# Altium project PCB_Project.PrjPcb
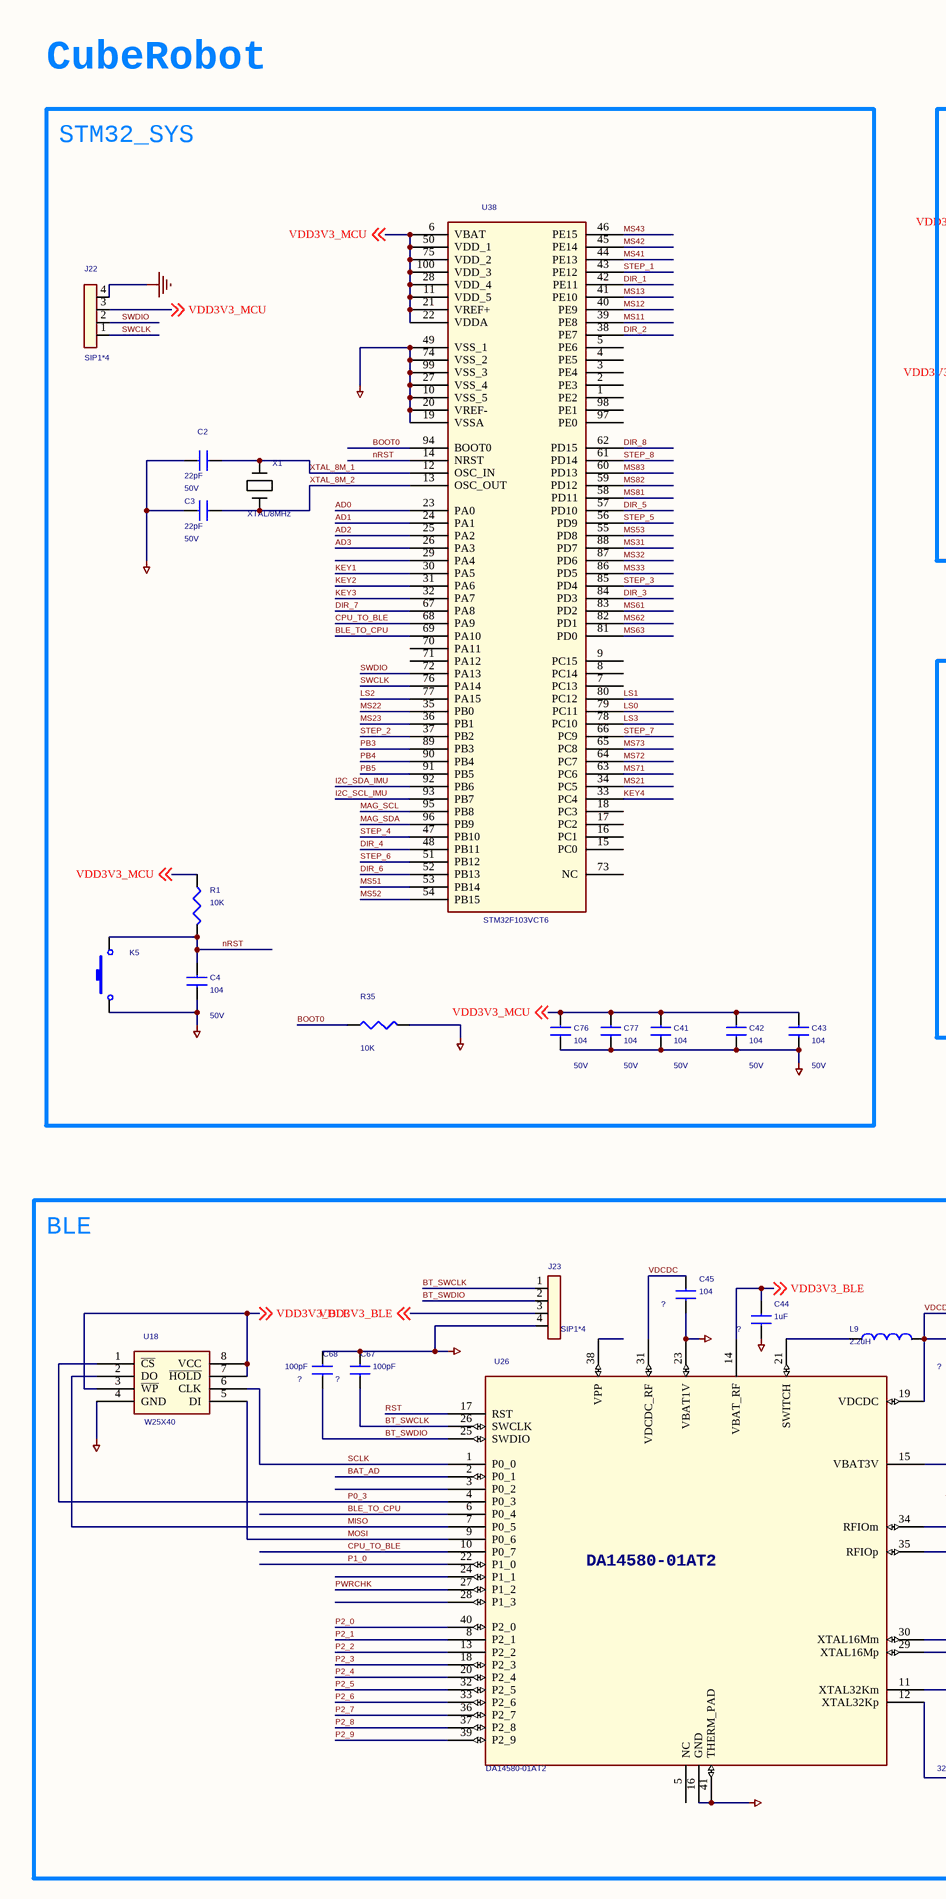
[diagram p0: Cube_Robot.SchDoc, left]
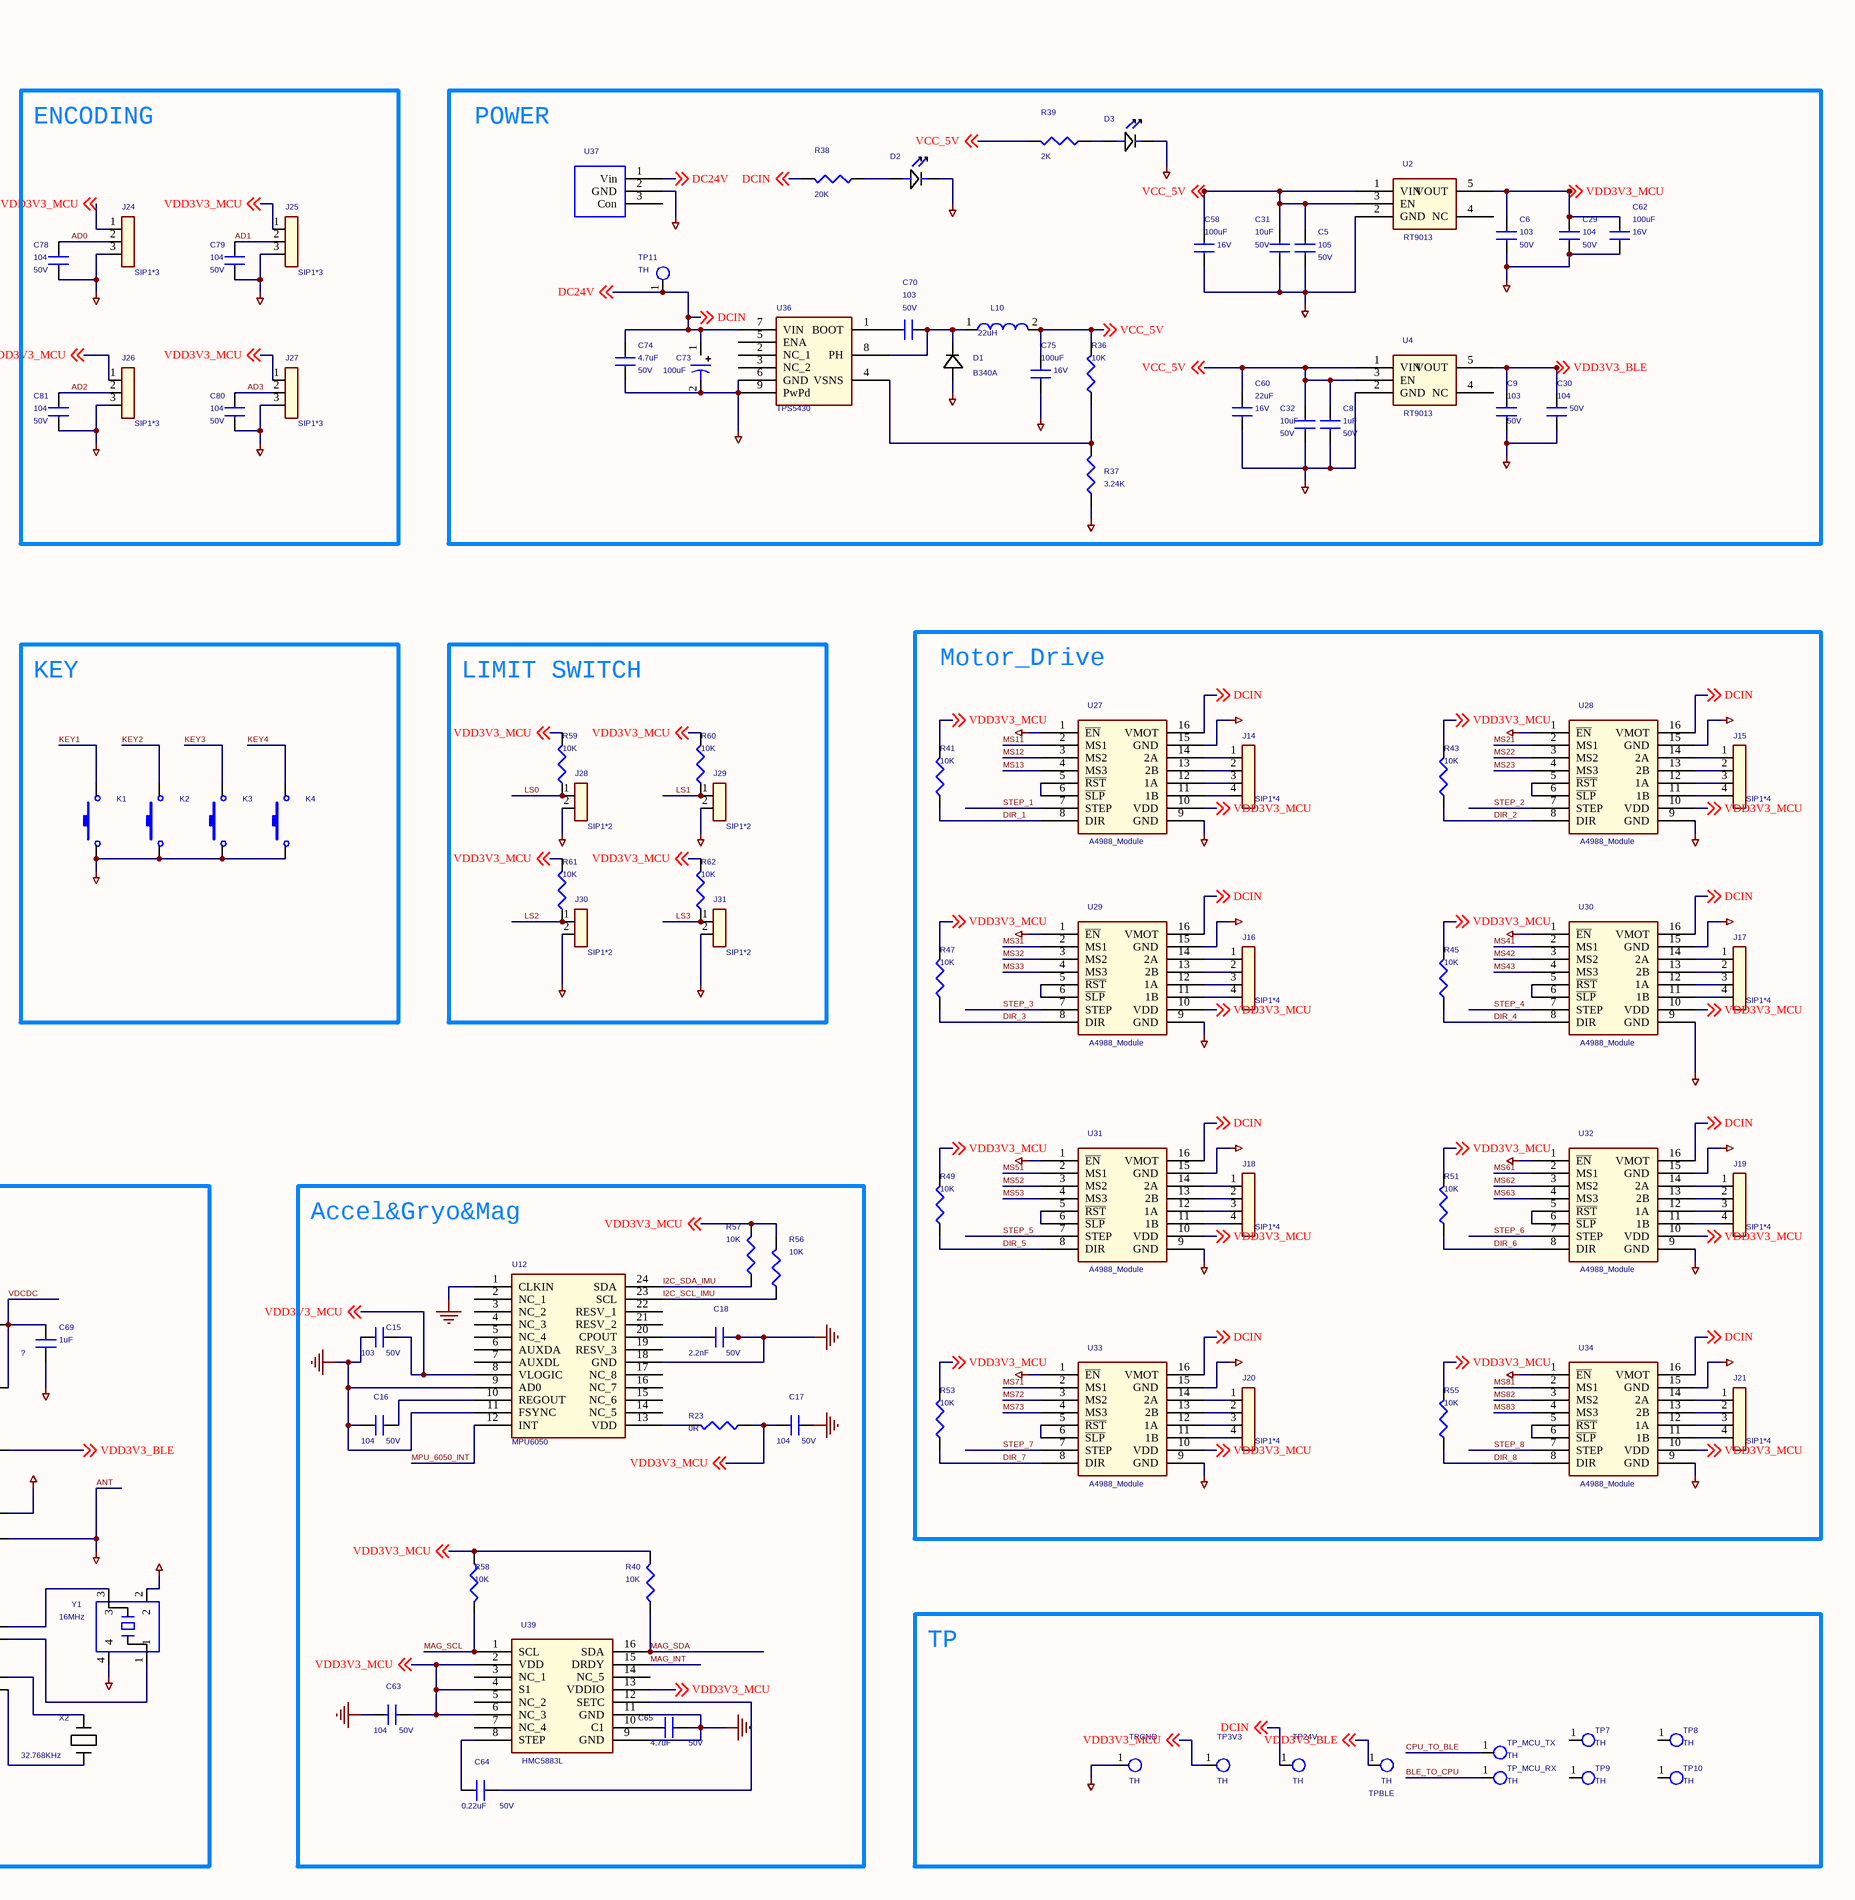
[diagram p1: Cube_Robot.SchDoc, right]
1 sheet, 121 parts. Net scope: global (net labels, ports and power ports of the same name join across sheets).
Board file: Cube_Robot.PcbDoc

## Sheet Cube_Robot.SchDoc
size 594 x 420 mm

### Parts
C2  22pF  Power Consumption: 50V  [0603C]
C3  22pF  Power Consumption: 50V  [0603C]
C4  104  Power Consumption: 50V  [0603C]
C5  105  Power Consumption: 50V  [0603C]
C6  103  Power Consumption: 50V  [0603C]
C8  1uF  Power Consumption: 50V  [0603C]
C9  103  Power Consumption: 50V  [0603C]
C15  103  Power Consumption: 50V  [0603C]
C16  104  Power Consumption: 50V  [0603C]
C17  104  Power Consumption: 50V  [0603C]
C18  2.2nF  Power Consumption: 50V  [0603C]
C29  104  Power Consumption: 50V  [0603C]
C30  104  Power Consumption: 50V  [0603C]
C31  10uF  Power Consumption: 50V  [0603C]
C32  10uF  Power Consumption: 50V  [0603C]
C41  104  Power Consumption: 50V  [0603C]
C42  104  Power Consumption: 50V  [0603C]
C43  104  Power Consumption: 50V  [0603C]
C44  1uF  [0603C]
C45  104  [0603C]
C58  100uF  Power Consumption: 16V  [1206C]
C60  22uF  Power Consumption: 16V  [1206C]
C62  100uF  Power Consumption: 16V  [1206C]
C63  104  Power Consumption: 50V  [0603C]
C64  0.22uF  Power Consumption: 50V  [0603C]
C65  4.7uF  Power Consumption: 50V  [0603C]
C67  100pF  [0603C]
C68  100pF  [0603C]
C69  1uF  [0603C]
C70  103  Power Consumption: 50V  [0603C]
C73  100uF  [贴片电解电容]
C74  4.7uF  Power Consumption: 50V  [0603C]
C75  100uF  Power Consumption: 16V  [1206C]
C76  104  Power Consumption: 50V  [0603C]
C77  104  Power Consumption: 50V  [0603C]
C78  104  Power Consumption: 50V  [0603C]
C79  104  Power Consumption: 50V  [0603C]
C80  104  Power Consumption: 50V  [0603C]
C81  104  Power Consumption: 50V  [0603C]
D1  B340A  [IN4148]
D2  LED  [0805]  (value not drawn)
D3  LED  [0805]  (value not drawn)
J14  SIP1*4  [DIP1x4]
J15  SIP1*4  [DIP1x4]
J16  SIP1*4  [DIP1x4]
J17  SIP1*4  [DIP1x4]
J18  SIP1*4  [DIP1x4]
J19  SIP1*4  [DIP1x4]
J20  SIP1*4  [DIP1x4]
J21  SIP1*4  [DIP1x4]
J22  SIP1*4  [DIP1x4]
J23  SIP1*4  [DIP1x4]
J24  SIP1*3  [DIP1x3]
J25  SIP1*3  [DIP1x3]
J26  SIP1*3  [DIP1x3]
J27  SIP1*3  [DIP1x3]
J28  SIP1*2  [SIP-2-2R5]
J29  SIP1*2  [SIP-2-2R5]
J30  SIP1*2  [SIP-2-2R5]
J31  SIP1*2  [SIP-2-2R5]
K1  KEY  [侧向贴片按键]  (value not drawn)
K2  KEY  [侧向贴片按键]  (value not drawn)
K3  KEY  [侧向贴片按键]  (value not drawn)
K4  KEY  [侧向贴片按键]  (value not drawn)
K5  KEY  [侧向贴片按键]  (value not drawn)
L9  2.2uH  [cl0707m]
L10  22uH  [大电感]
R1  10K  [0603R]
R23  0R  [0603R]
R35  10K  [0603R]
R36  10K  [0603R]
R37  3.24K  [0805R]
R38  20K  [0603R]
R39  2K  [0603R]
R40  10K  [0603R]
R41  10K  [0603R]
R43  10K  [0603R]
R45  10K  [0603R]
R47  10K  [0603R]
R49  10K  [0603R]
R51  10K  [0603R]
R53  10K  [0603R]
R55  10K  [0603R]
R56  10K  [0603R]
R57  10K  [0603R]
R58  10K  [0603R]
R59  10K  [0603R]
R60  10K  [0603R]
R61  10K  [0603R]
R62  10K  [0603R]
TP3V3  TH  [TP_TH]
TP7  TH  [HOLES-3R00]
TP8  TH  [HOLES-3R00]
TP9  TH  [HOLES-3R00]
TP10  TH  [HOLES-3R00]
TP11  TH  [TP_TH]
TP24V  TH  [TP_TH]
TP_MCU_RX  TH  [TP_TH]
TP_MCU_TX  TH  [TP_TH]
TPBLE  TH  [TP_TH]
TPGND  TH  [TP_TH]
U2  RT9013  [SOT23-5]
U4  RT9013  [SOT23-5]
U12  MPU6050  [QFN24]
U18  W25X40  [SOP8_NOPAD]
U26  DA14580-01AT2  [QFN40_5_5]
U27  A4988_Module  [A4988]
U28  A4988_Module  [A4988]
U29  A4988_Module  [A4988]
U30  A4988_Module  [A4988]
U31  A4988_Module  [A4988]
U32  A4988_Module  [A4988]
U33  A4988_Module  [A4988]
U34  A4988_Module  [A4988]
U36  TPS5430  [SOP8]
U37  DC005  [DC005]  (value not drawn)
U38  STM32F103VCT6  [LQFP100]
U39  HMC5883L  [HMC5883L]
X1  XTAL/8MHz  [XTAL_3x8]
X2  32.768KHz  [XTAL_3x8]
Y1  16MHz  [smd_32768hz]

### Blocks framed on the sheet
STM32_SYS: C2-C4 C41-C43 C76 C77 J22 K5 R1 R35 U38 X1
ENCODING: C78-C81 J24-J27
POWER: C5 C6 C8 C9 C29-C32 C58 C60 C62 C70 C73-C75 D1-D3 L10 R36-R39 TP11 U2 U4 U36 U37
KEY: K1-K4
LIMIT SWITCH: J28-J31 R59-R62
Motor_Drive: J14-J21 R41 R43 R45 R47 R49 R51 R53 R55 U27-U34
BLE: C44 C45 C67-C69 J23 L9 U18 U26 X2 Y1
Accel&Gryo&Mag: C15-C18 C63-C65 R23 R40 R56-R58 U12 U39
TP: TP3V3 TP7-TP10 TP24V TP_MCU_RX TP_MCU_TX TPBLE TPGND

### Nets
ANT: C2.1 C3.1 C4.1 C5.1 C6.1 C8.1 C9.1 C15.1 C16.1 C17.2 C18.2 C29.1 C30.1 C31.1 C32.1 C41.1 C42.1 C43.1 C44.2 C45.2 C58.1 C60.1 C62.1 C63.1 C65.2 C67.1 C68.1 C69.2 C73.2 C74.1 C75.1 C76.1 C77.1 C78.1 C79.1 C80.1 C81.1 D1.1 D2.2 D3.2 J22.4 J23.4 J24.3 J25.3 J26.3 J27.3 J28.2 J29.2 J30.2 J31.2 K1.1 K2.1 K3.1 K4.1 K5.1 R35.2 R37.1 TPGND.1 U2.2(GND) U4.2(GND) U12.1(CLKIN) U12.9(AD0) U12.11(FSYNC) U12.18(GND) U18.4(GND) U26.16(GND) U26.23(VBAT1V) U26.34(RFIOm) U26.35(RFIOp) U26.41(THERM_PAD) U27.1(~{EN}) U27.9(GND) U27.15(GND) U28.1(~{EN}) U28.9(GND) U28.15(GND) U29.1(~{EN}) U29.9(GND) U29.15(GND) U30.1(~{EN}) U30.9(GND) U30.15(GND) U31.1(~{EN}) U31.9(GND) U31.15(GND) U32.1(~{EN}) U32.9(GND) U32.15(GND) U33.1(~{EN}) U33.9(GND) U33.15(GND) U34.1(~{EN}) U34.9(GND) U34.15(GND) U36.6(GND) U36.9(PwPd) U37.2(GND) U38.10(VSS_5) U38.19(VSSA) U38.20(VREF-) U38.27(VSS_4) U38.49(VSS_1) U38.74(VSS_2) U38.99(VSS_3) U39.9(GND) U39.11(GND) Y1.2 Y1.4  [also labelled GND]
AD0: C78.2 J24.2 U38.23(PA0)
AD1: C79.2 J25.2 U38.24(PA1)
AD2: C81.2 J26.2 U38.25(PA2)
AD3: C80.2 J27.2 U38.26(PA3)
BAT_AD: U26.2(P0_1)
BLE_TO_CPU: TP_MCU_RX.1 U26.6(P0_4) U38.69(PA10)
BOOT0: R35.1 U38.94(BOOT0)
BT_SWCLK: C67.2 J23.1 U26.26(SWCLK)
BT_SWDIO: C68.2 J23.2 U26.25(SWDIO)
CPU_TO_BLE: TP_MCU_TX.1 U26.10(P0_7) U38.68(PA9)
DC24V: C73.1 C74.2 R38.2 TP11.1 TP24V.1 U27.16(VMOT) U28.16(VMOT) U29.16(VMOT) U30.16(VMOT) U31.16(VMOT) U32.16(VMOT) U33.16(VMOT) U34.16(VMOT) U36.7(VIN) U37.1(Vin) ; off-sheet DCIN, off-sheet DC24V  [also labelled DCIN]
DIR_1: R41.1 U27.8(DIR) U38.42(PE11)
DIR_2: R43.1 U28.8(DIR) U38.38(PE7)
DIR_3: R47.1 U29.8(DIR) U38.84(PD3)
DIR_4: R45.1 U30.8(DIR) U38.48(PB11)
DIR_5: R49.1 U31.8(DIR) U38.57(PD10)
DIR_6: R51.1 U32.8(DIR) U38.52(PB13)
DIR_7: R53.1 U33.8(DIR) U38.67(PA8)
DIR_8: R55.1 U34.8(DIR) U38.62(PD15)
I2C_SCL_IMU: R56.1 U12.23(SCL) U38.93(PB7)
I2C_SDA_IMU: R57.1 U12.24(SDA) U38.92(PB6)
KEY1: K1.2 U38.30(PA5)
KEY2: K2.2 U38.31(PA6)
KEY3: K3.2 U38.32(PA7)
KEY4: K4.2 U38.33(PC4)
LS0: J28.1 R59.1 U38.79(PC11)
LS1: J29.1 R60.1 U38.80(PC12)
LS2: J30.1 R61.1 U38.77(PA15)
LS3: J31.1 R62.1 U38.78(PC10)
MAG_INT: U39.15(DRDY)
MAG_SCL: R58.2 U38.95(PB8) U39.1(SCL)
MAG_SDA: R40.1 U38.96(PB9) U39.16(SDA)
MISO: U18.2(DO) U26.7(P0_5)
MOSI: U18.5(DI) U26.9(P0_6)
MPU_6050_INT: U12.12(INT)
MS11: U27.2(MS1) U38.39(PE8)
MS12: U27.3(MS2) U38.40(PE9)
MS13: U27.4(MS3) U38.41(PE10)
MS21: U28.2(MS1) U38.34(PC5)
MS22: U28.3(MS2) U38.35(PB0)
MS23: U28.4(MS3) U38.36(PB1)
MS31: U29.2(MS1) U38.88(PD7)
MS32: U29.3(MS2) U38.87(PD6)
MS33: U29.4(MS3) U38.86(PD5)
MS41: U30.2(MS1) U38.44(PE13)
MS42: U30.3(MS2) U38.45(PE14)
MS43: U30.4(MS3) U38.46(PE15)
MS51: U31.2(MS1) U38.53(PB14)
MS52: U31.3(MS2) U38.54(PB15)
MS53: U31.4(MS3) U38.55(PD8)
MS61: U32.2(MS1) U38.83(PD2)
MS62: U32.3(MS2) U38.82(PD1)
MS63: U32.4(MS3) U38.81(PD0)
MS71: U33.2(MS1) U38.63(PC6)
MS72: U33.3(MS2) U38.64(PC7)
MS73: U33.4(MS3) U38.65(PC8)
MS81: U34.2(MS1) U38.58(PD11)
MS82: U34.3(MS2) U38.59(PD12)
MS83: U34.4(MS3) U38.60(PD13)
nRST: C4.2 K5.2 R1.2 U38.14(NRST)
P0_3: U18.1(~{CS}) U26.4(P0_3)
P1_0: U26.22(P1_0)
P2_0: U26.40(P2_0)
P2_1: U26.8(P2_1)
P2_2: U26.13(P2_2)
P2_3: U26.18(P2_3)
P2_4: U26.20(P2_4)
P2_5: U26.32(P2_5)
P2_6: U26.33(P2_6)
P2_7: U26.36(P2_7)
P2_8: U26.37(P2_8)
P2_9: U26.39(P2_9)
PB3: U38.89(PB3)
PB4: U38.90(PB4)
PB5: U38.91(PB5)
PWRCHK: U26.27(P1_2)
RST: U26.17(RST)
SCLK: U18.6(CLK) U26.1(P0_0)
STEP_1: U27.7(STEP) U38.43(PE12)
STEP_2: U28.7(STEP) U38.37(PB2)
STEP_3: U29.7(STEP) U38.85(PD4)
STEP_4: U30.7(STEP) U38.47(PB10)
STEP_5: U31.7(STEP) U38.56(PD9)
STEP_6: U32.7(STEP) U38.51(PB12)
STEP_7: U33.7(STEP) U38.66(PC9)
STEP_8: U34.7(STEP) U38.61(PD14)
SWCLK: J22.1 U38.76(PA14)
SWDIO: J22.2 U38.72(PA13)
VCC_5V: C5.2 C8.2 C31.2 C32.2 C58.2 C60.2 C75.2 L10.2 R36.2 R39.2 U2.1(VIN) U2.3(EN) U4.1(VIN) U4.3(EN) ; off-sheet VCC_5V
VDCDC: C45.1 C69.1 L9.2 U26.19(VDCDC) U26.31(VDCDC_RF)
VDD3V3_BLE: C9.2 C30.2 C44.1 J23.3 TPBLE.1 U4.5(VOUT) U18.3(~{WP}) U18.7(~{HOLD}) U18.8(VCC) U26.14(VBAT_RF) U26.15(VBAT3V) ; off-sheet VDD3V3_BLE
VDD3V3_MCU: C6.2 C15.2 C17.1 C29.2 C41.2 C42.2 C43.2 C62.2 C63.2 C76.2 C77.2 J22.3 J24.1 J25.1 J26.1 J27.1 R1.1 R23.1 R40.2 R41.2 R43.2 R45.2 R47.2 R49.2 R51.2 R53.2 R55.2 R56.2 R57.2 R58.1 R59.2 R60.2 R61.2 R62.2 TP3V3.1 U2.5(VOUT) U12.8(VLOGIC) U27.10(VDD) U28.10(VDD) U29.10(VDD) U30.10(VDD) U31.10(VDD) U32.10(VDD) U33.10(VDD) U34.10(VDD) U38.6(VBAT) U38.11(VDD_5) U38.21(VREF+) U38.22(VDDA) U38.28(VDD_4) U38.50(VDD_1) U38.75(VDD_2) U38.100(VDD_3) U39.2(VDD) U39.4(S1) U39.6(NC_3) U39.13(VDDIO) ; off-sheet VDD3V3_MCU
XTAL_8M_1: C2.2 U38.12(OSC_IN) X1.2
XTAL_8M_2: C3.2 U38.13(OSC_OUT) X1.1
NetC16_2: C16.2 U12.10(REGOUT)
NetC18_1: C18.1 U12.20(CPOUT)
NetC64_1: C64.1 U39.8(STEP)
NetC64_2: C64.2 U39.12(SETC)
NetC65_1: C65.1 U39.10(C1)
NetC70_1: C70.1 U36.1(BOOT)
NetC70_2: C70.2 D1.2 L10.1 U36.8(PH)
NetD2_1: D2.1 R38.1
NetD3_1: D3.1 R39.1
NetJ14_1: J14.1 U27.14(2A)
NetJ14_2: J14.2 U27.13(2B)
NetJ14_3: J14.3 U27.12(1A)
NetJ14_4: J14.4 U27.11(1B)
NetJ15_1: J15.1 U28.14(2A)
NetJ15_2: J15.2 U28.13(2B)
NetJ15_3: J15.3 U28.12(1A)
NetJ15_4: J15.4 U28.11(1B)
NetJ16_1: J16.1 U29.14(2A)
NetJ16_2: J16.2 U29.13(2B)
NetJ16_3: J16.3 U29.12(1A)
NetJ16_4: J16.4 U29.11(1B)
NetJ17_1: J17.1 U30.14(2A)
NetJ17_2: J17.2 U30.13(2B)
NetJ17_3: J17.3 U30.12(1A)
NetJ17_4: J17.4 U30.11(1B)
NetJ18_1: J18.1 U31.14(2A)
NetJ18_2: J18.2 U31.13(2B)
NetJ18_3: J18.3 U31.12(1A)
NetJ18_4: J18.4 U31.11(1B)
NetJ19_1: J19.1 U32.14(2A)
NetJ19_2: J19.2 U32.13(2B)
NetJ19_3: J19.3 U32.12(1A)
NetJ19_4: J19.4 U32.11(1B)
NetJ20_1: J20.1 U33.14(2A)
NetJ20_2: J20.2 U33.13(2B)
NetJ20_3: J20.3 U33.12(1A)
NetJ20_4: J20.4 U33.11(1B)
NetJ21_1: J21.1 U34.14(2A)
NetJ21_2: J21.2 U34.13(2B)
NetJ21_3: J21.3 U34.12(1A)
NetJ21_4: J21.4 U34.11(1B)
NetL9_1: L9.1 U26.21(SWITCH)
NetR23_2: R23.2 U12.13(VDD)
NetR36_1: R36.1 R37.2 U36.4(VSNS)
NetU26_11: U26.11(XTAL32Km) X2.2
NetU26_12: U26.12(XTAL32Kp) X2.1
NetU26_29: U26.29(XTAL16Mp) Y1.1
NetU26_30: U26.30(XTAL16Mm) Y1.3
NetU27_5: U27.5(~{RST}) U27.6(~{SLP})
NetU28_5: U28.5(~{RST}) U28.6(~{SLP})
NetU29_5: U29.5(~{RST}) U29.6(~{SLP})
NetU30_5: U30.5(~{RST}) U30.6(~{SLP})
NetU31_5: U31.5(~{RST}) U31.6(~{SLP})
NetU32_5: U32.5(~{RST}) U32.6(~{SLP})
NetU33_5: U33.5(~{RST}) U33.6(~{SLP})
NetU34_5: U34.5(~{RST}) U34.6(~{SLP})

Not connected (* = marked no-connect by the designer): TP7 1; TP8 1; TP9 1; TP10 1; U2 4(NC); U4 4(NC); U12 2(NC_1) 3(NC_2) 4(NC_3) 5(NC_4) 6(AUXDA) 7(AUXDL) 14(NC_5) 15(NC_6) 16(NC_7) 17(NC_8) 19(RESV_3) 21(RESV_2) 22(RESV_1); U26 3(P0_2) 5(NC) 24(P1_1) 28(P1_3) 38(VPP); U36 2(NC_1) 3(NC_2) 5(ENA); U37 3(Con); U38 1(PE2) 2(PE3) 3(PE4) 4(PE5) 5(PE6) 7(PC13) 8(PC14) 9(PC15) 15(PC0) 16(PC1) 17(PC2) 18(PC3) 29(PA4) 70(PA11) 71(PA12) 73(NC) 97(PE0) 98(PE1); U39 3(NC_1) 5(NC_2) 7(NC_4) 14(NC_5)

### Notes on the sheet
- CubeRobot

### Library data of the parts
C2 C3 C5 C8 C30 C32 C41-C43 C58 C74 C75 = CAPNP: 料号: HB118; 描述: 贴片电容0603/X5R/18pF/±10%/50V RoHS; 类型: 贴片陶瓷电容; 器件资料: CAP.PDF; 备注: 已有
C4 C6 C9 C29 C31 C60 C62 C70 C76-C81 = CAPNP: 备注: 已有; 器件资料: CAP.PDF; 类型: 贴片陶瓷电容; 描述: 贴片电容0603/X5R/18pF/±10%/50V RoHS; 料号: HB118
C15 C17 C63-C65 C69 = CAPNP: 料号: CN-0010-00; 类型: 贴片陶瓷电容; 描述: 104 50V 0603 X5R ±10% ROHS; 器件资料: CAP.PDF; 备注: 不推荐
  C69: Power Consumption: ?
C16 C18 C44 C45 = CAPNP: 备注: 不推荐; 器件资料: CAP.PDF; 描述: 104 50V 0603 X5R ±10% ROHS; 类型: 贴片陶瓷电容; 料号: CN-0010-00
  C44 C45: Power Consumption: ?
C67 = CAPNP: 料号: CN-1000-00; 描述: 106 6.3V 0603 X5R ±20% ROHS; 类型: 贴片陶瓷电容; 器件资料: CAP.PDF; 备注: 不推荐; Power Consumption: ?
C68 = CAPNP: 备注: 不推荐; 器件资料: CAP.PDF; 类型: 贴片陶瓷电容; 描述: 106 6.3V 0603 X5R ±20% ROHS; 料号: CN-1000-00; Power Consumption: ?
C73 = Capacitor2
D1 = DIODE
J14-J23 = DIP1x4
J24-J27 = DIP1x3
J28-J31 = SIP-2
L9 = IND: part number: 1.6.LI-1105-A0; 料号: LI-3150-10; 类型: 贴片陶瓷电感; 描述: 6.8nH 0603 ROHS; 电流: signal; 备注: 不推荐
L10 = Inductor
R1 R37 R39 R51 R61 R62 = RESSMD: part number: 1.3.1.RS-0011-70; CODE: RS-1003-00; 料号: HB195; 描述: 精密贴片电阻/56K/0603/±1%，1/16W RoHS; 类型: 片阻; 器件资料: RES.PDF; 备注: 已有; 精度: 0.01
R23 = RESSMD: part number: 1.3.1.RS-0011-70; CODE: RS-1003-00; 料号: RS-1004-00; 描述: 贴片电阻/100K/0603/±5%,1/16W RoHS; 类型: 片阻; 器件资料: RES.PDF; 备注: 不推荐; 精度: 0.05
R35 R36 R38 R41 R43 R45 R47 R49 R53 R55 R59 R60 = RESSMD: part number: 1.3.1.RS-0011-70; CODE: RS-1003-00; 精度: 0.01; 备注: 已有; 器件资料: RES.PDF; 类型: 片阻; 描述: 精密贴片电阻/56K/0603/±1%，1/16W RoHS; 料号: HB195
R40 R56-R58 = RESSMD: part number: 1.3.1.RS-0011-70; CODE: RS-1003-00; 精度: 0.05; 备注: 已有; 器件资料: RES.PDF; 类型: 片阻; 描述: 贴片电阻/4.7K/0603/±5%，1/16W RoHS; 料号: HB79
TP3V3 TP7-TP11 TP24V TPBLE TPGND = TP: 备注: 推荐; 器件资料: NONE; 描述: 测试孔,孔径1mm; 类型: 机械; 品牌: NONE; 料号: NONE
TP_MCU_RX TP_MCU_TX = TP: 料号: NONE; 类型: 机械; 描述: 测试孔,孔径1mm; 备注: 推荐; 品牌: NONE; 器件资料: NONE
U18 = W25X40CL
U38 = STM32F103VXT6
X1 X2 = XTAL
Y1 = OSC3225: 料号: CY-3200-00; 类型: 无源晶振; 描述: 贴片无源晶振/32MHz/3.2X2.5MM/4PIN; 器件资料: OSC3225.PDF; 备注: 不推荐